# Altium schematic sheet Driver.SchDoc
size A3
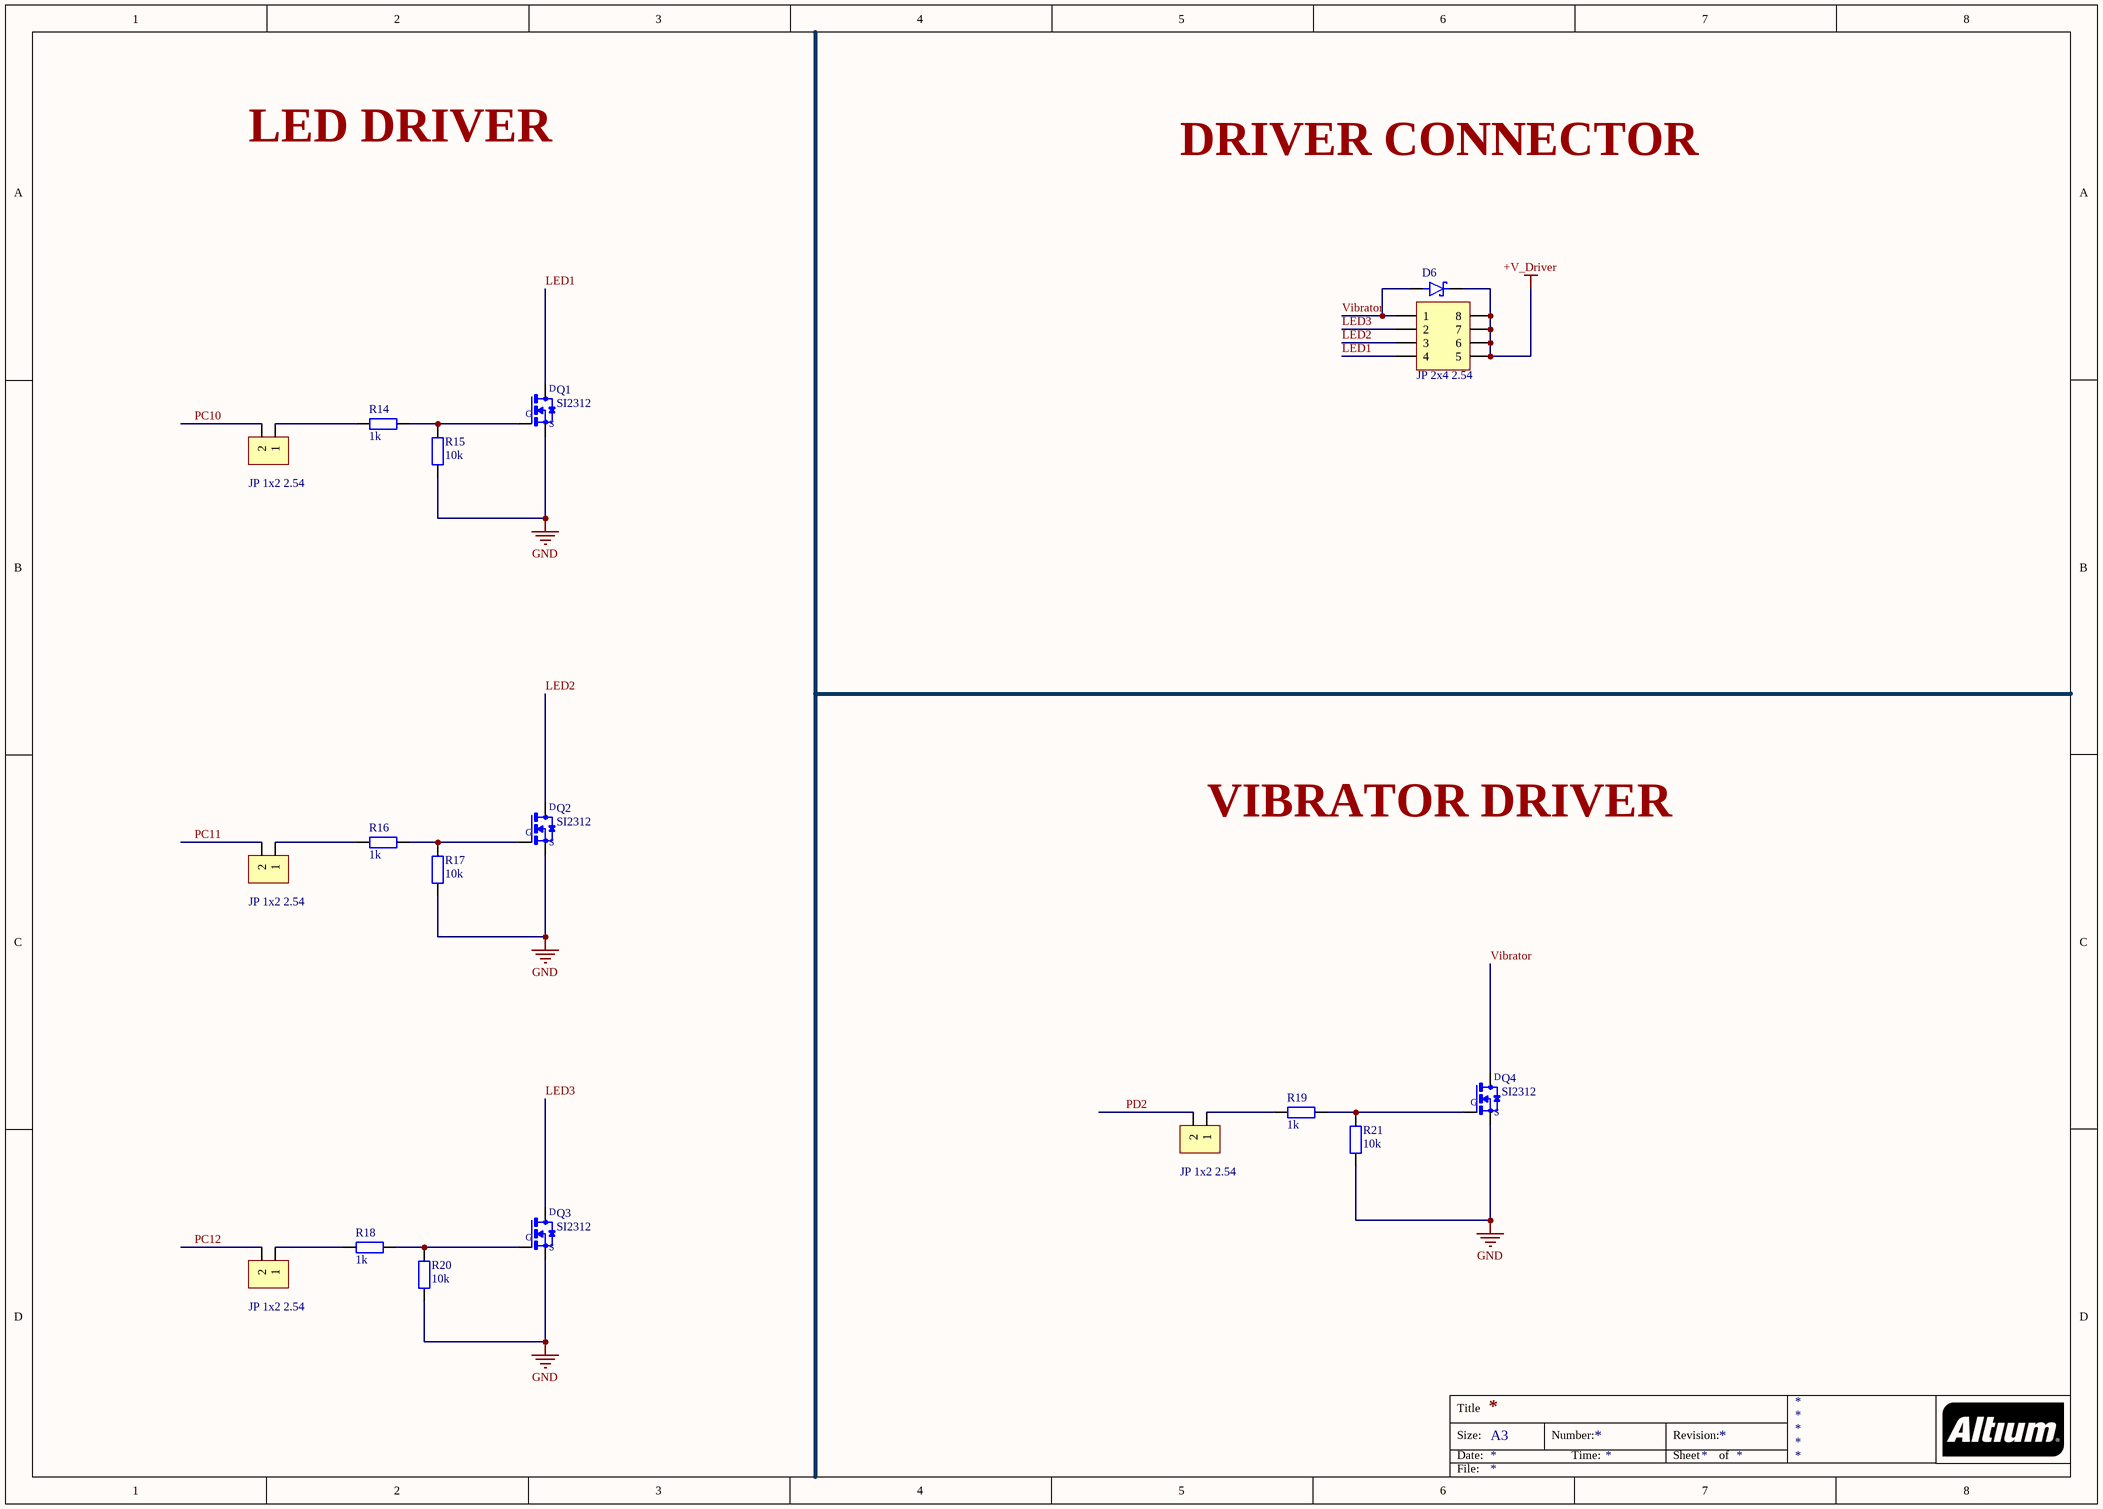
[diagram p0: Driver.SchDoc]

## Parts
D6  1N5819HW-7-F  [SOD3715X145N]  (value not drawn)
Driver1  JP 2x4 2.54  [JP 2x4 DT]
JP2  JP 1x2 2.54  [JP 1x2 DT]
JP3  JP 1x2 2.54  [JP 1x2 DT]
JP4  JP 1x2 2.54  [JP 1x2 DT]
JP5  JP 1x2 2.54  [JP 1x2 DT]
Q1  SI2312  [SOT23]
Q2  SI2312  [SOT23]
Q3  SI2312  [SOT23]
Q4  SI2312  [SOT23]
R14  1k  [tro smd 0603]
R15  10k  [tro smd 0603]
R16  1k  [tro smd 0603]
R17  10k  [tro smd 0603]
R18  1k  [tro smd 0603]
R19  1k  [tro smd 0603]
R20  10k  [tro smd 0603]
R21  10k  [tro smd 0603]

## Nets
+V_Driver: D6.C(K) Driver1.5 Driver1.6 Driver1.7 Driver1.8
GND: Q1.2(S) Q2.2(S) Q3.2(S) Q4.2(S) R15.1 R17.1 R20.1 R21.1
LED1: Driver1.4 Q1.3(D)
LED2: Driver1.3 Q2.3(D)
LED3: Driver1.2 Q3.3(D)
PC10: JP2.2
PC11: JP3.2
PC12: JP4.2
PD2: JP5.2
Vibrator: D6.A Driver1.1 Q4.3(D)
NetJP2_1: JP2.1 R14.1
NetJP3_1: JP3.1 R16.1
NetJP4_1: JP4.1 R18.1
NetJP5_1: JP5.1 R19.1
NetQ1_1: Q1.1(G) R14.2 R15.2
NetQ2_1: Q2.1(G) R16.2 R17.2
NetQ3_1: Q3.1(G) R18.2 R20.2
NetQ4_1: Q4.1(G) R19.2 R21.2

## Notes on the sheet
- LED DRIVER
- DRIVER CONNECTOR
- VIBRATOR DRIVER
- Title
- Size:
- Date:
- A3
- Number:
- Time:
- Revision:
- Sheet
- of
- File:

## Library data of the parts
D6 = 1N5819HW-7-F: 1N5819HW Series 40 V 1 A Surface Mount Schottky Barrier Rectifier - SOD-123; MF: {'manufacturer': u'Diodes Inc.'}; Package: None; Price: None; Value: *; MP: 1N5819HW-7-F; Availability: Unavailable
Driver1 = JP 2x4 2.54 Duc Thang: Cắm; Ten_Linh_Kien: Jump Đôi Đực 2.54MM 2x40P Thẳng 11MM; Don_Vi: Con; Ma_Hang: MH002686; Ghi_Chu: *; Kieu_Chan: *; Chung_Loai: Cắm
JP2-JP5 = JP 1x2 2.54 Duc Thang: Cắm; Ten_Linh_Kien: Jump Đơn Đực 2.54MM 1x40P Thẳng 11MM; Don_Vi: Con; Ma_Hang: MH000903; Ghi_Chu: *; Kieu_Chan: *; Chung_Loai: Cắm
Q1-Q4 = SI2312: <b>N-Channel MOSFET</b>    <a href="https://pricing.snapeda.com/parts/SI2312/Micro%20Commercial%20Components/view-part?ref=eda">Check availability</a> <a href="https://pricing.snapeda.com/parts/SI2312/Micro%20Commercial%20Components/view-part?ref=eda">Check availability</a>; MF: {'manufacturer': u'Micro Commercial Components'}; MP: SI2312-TP; Package: None; Price: None; Value: *; Availability: Unavailable
R14 R16 R18 R19 = Tro 0603 1% 1k: Dán; So_Chan: 2; Don_Vi: Con; Ten_Linh_Kien: Trở 0603 1% 1k; Ma_Hang: MH006334; Chung_Loai: Dán; Kieu_Chan: *
R15 R17 R20 R21 = Tro 0603 1% 10k: Dán; Don_Vi: Con; So_Chan: 2; Ten_Linh_Kien: Trở 0603 1% 10k; Ma_Hang: MH006333; Chung_Loai: Dán; Kieu_Chan: *